# Altium schematic sheet Esquemátic.SchDoc
size A4; SheetNumber: 1; SheetTotal: 1
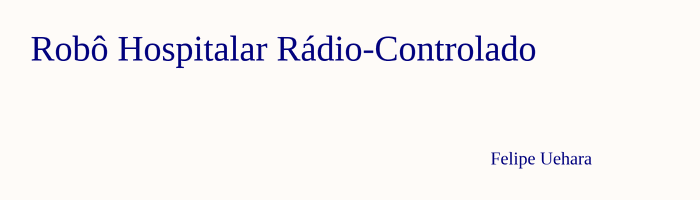
[diagram p0: Esquemátic.SchDoc]

## Notes on the sheet
- Robô Hospitalar Rádio-Controlado
- Felipe Uehara